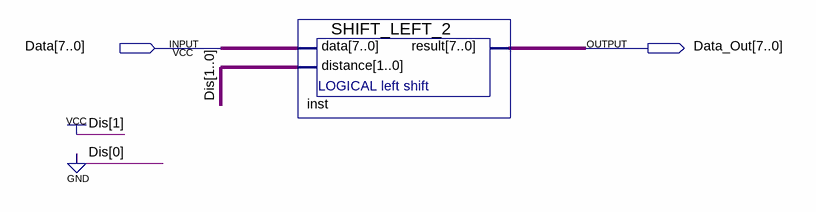
[diagram p0: schematic sheet]
// Quartus schematic Shift_left_two.bdf as structural Verilog: 1 symbols, 2 pins
module Shift_left_two (
  input  [7:0] Data,
  output [7:0] Data_Out
);

  SHIFT_LEFT_2 inst (.data(Data), .distance(2'b10), .result(Data_Out));
endmodule
